# EAGLE schematic pl (EAGLE 7.7.0)
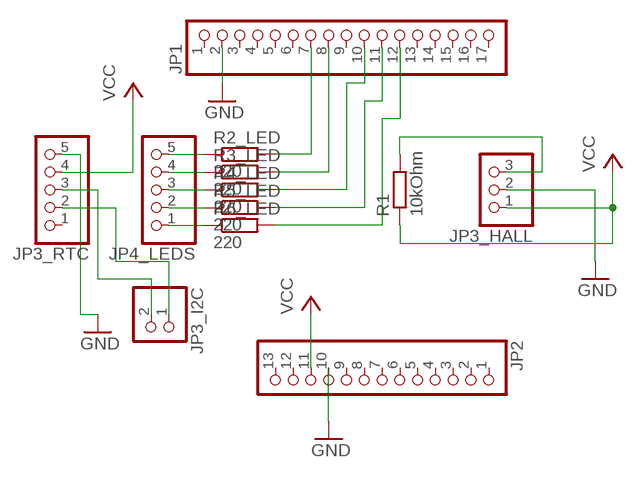
[diagram p0: schematic, sheet 1]

## Parts
JP1  PINHD-1X17  [1X17]
JP2  PINHD-1X13  [1X13]
JP3_HALL  PINHD-1X3  [1X03]
JP3_I2C  PINHD-1X2  [1X02]
JP3_RTC  PINHD-1X5  [1X05]
JP4_LEDS  PINHD-1X5  [1X05]
R1  10kOhm  R-EU_R0805  [R0805]
R2_LED  220  R-EU_R0805  [R0805]
R3_LED  220  R-EU_R0805  [R0805]
R4_LED  220  R-EU_R0805  [R0805]
R5_LED  220  R-EU_R0805  [R0805]
R6_LED  220  R-EU_R0805  [R0805]

## Nets
GND: JP1.2 JP2.10 JP3_HALL.2 JP3_RTC.5
N$1: JP3_HALL.3 R1.2
N$2: JP4_LEDS.5 R2_LED.1
N$3: JP4_LEDS.4 R3_LED.1
N$4: JP4_LEDS.3 R4_LED.1
N$5: JP4_LEDS.2 R5_LED.1
N$6: JP4_LEDS.1 R6_LED.1
N$7: JP1.12 R6_LED.2
N$8: JP1.11 R5_LED.2
N$9: JP1.10 R4_LED.2
N$10: JP1.8 R3_LED.2
N$11: JP1.7 R2_LED.2
N$12: JP3_I2C.2 JP3_RTC.3
N$13: JP3_I2C.1 JP3_RTC.2
VCC: JP2.11 JP3_HALL.1 JP3_RTC.4 R1.1
Unconnected: JP1.1 JP1.3 JP1.4 JP1.5 JP1.6 JP1.9 JP1.13 JP1.14 JP1.15 JP1.16 JP1.17 JP2.1 JP2.2 JP2.3 JP2.4 JP2.5 JP2.6 JP2.7 JP2.8 JP2.9 JP2.12 JP2.13 JP3_RTC.1

## Library data of the parts
JP1 = pinhead:PINHD-1X17: PIN HEADER
JP2 = pinhead:PINHD-1X13: PIN HEADER
JP3_HALL = pinhead:PINHD-1X3: PIN HEADER
JP3_I2C = pinhead:PINHD-1X2: PIN HEADER
JP3_RTC JP4_LEDS = pinhead:PINHD-1X5: PIN HEADER
R1 = rcl:R-EU_: RESISTOR, European symbol
R2_LED R3_LED R4_LED R5_LED R6_LED = resistor:R-EU_: RESISTOR, European symbol